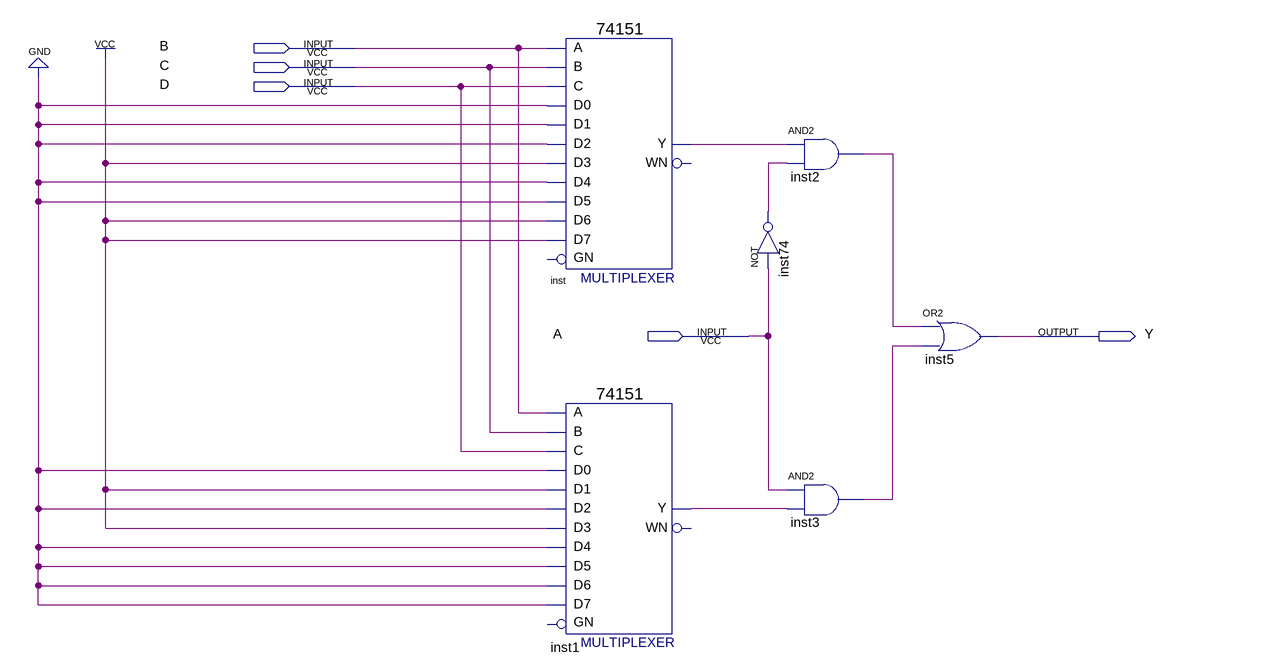
[diagram p0: schematic sheet]
// Quartus schematic Exp03.bdf as structural Verilog: 6 symbols, 5 pins
module Exp03 (
  input  B,
  input  C,
  input  D,
  input  A,
  output Y
);

  wire inst1_y, inst2_out, inst3_out, inst74_out, inst_y;

  \74151  inst (
    .C(D), .B(C), .A(B), .D5(1'b0), .D0(1'b0), .D1(1'b0), .D4(1'b0), .D3(1'b1), .D2(1'b0), .D6(1'b1),
    .D7(1'b1), .Y(inst_y));  // open: GN, WN
  \74151  inst1 (
    .C(D), .B(C), .A(B), .D5(1'b0), .D0(1'b0), .D1(1'b1), .D4(1'b0), .D3(1'b1), .D2(1'b0), .D6(1'b0),
    .D7(1'b0), .Y(inst1_y));  // open: GN, WN
  and inst2 (inst2_out, inst_y, inst74_out);
  not inst74 (inst74_out, A);
  and inst3 (inst3_out, A, inst1_y);
  or inst5 (Y, inst2_out, inst3_out);
endmodule
